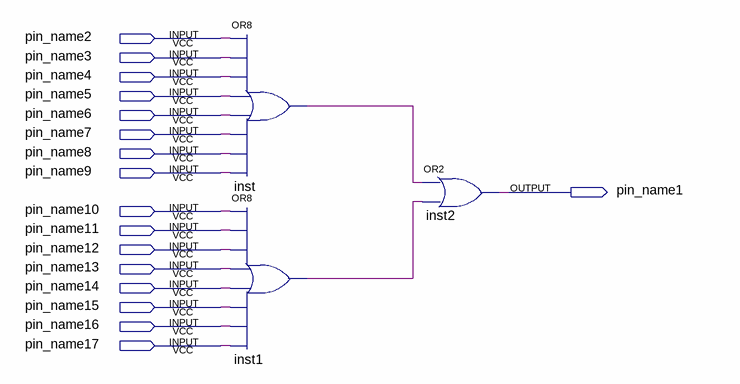
[diagram p0: schematic sheet]
// Quartus schematic or16.bdf as structural Verilog: 3 symbols, 17 pins
module or16 (
  input  pin_name2,
  input  pin_name3,
  input  pin_name4,
  input  pin_name5,
  input  pin_name6,
  input  pin_name7,
  input  pin_name8,
  input  pin_name9,
  input  pin_name10,
  input  pin_name11,
  input  pin_name12,
  input  pin_name13,
  input  pin_name14,
  input  pin_name15,
  input  pin_name16,
  input  pin_name17,
  output pin_name1
);

  wire inst1_out, inst_out;

  or inst (inst_out, pin_name2, pin_name3, pin_name4, pin_name5, pin_name6, pin_name7, pin_name8, pin_name9);
  or inst1 (inst1_out, pin_name10, pin_name11, pin_name12, pin_name13, pin_name14, pin_name15, pin_name16, pin_name17);
  or inst2 (pin_name1, inst_out, inst1_out);
endmodule
